# Altium schematic sheet Boost_Conv_V1.0_Power_Sch.SchDoc
size A4; SheetNumber: 1; SheetTotal: 3
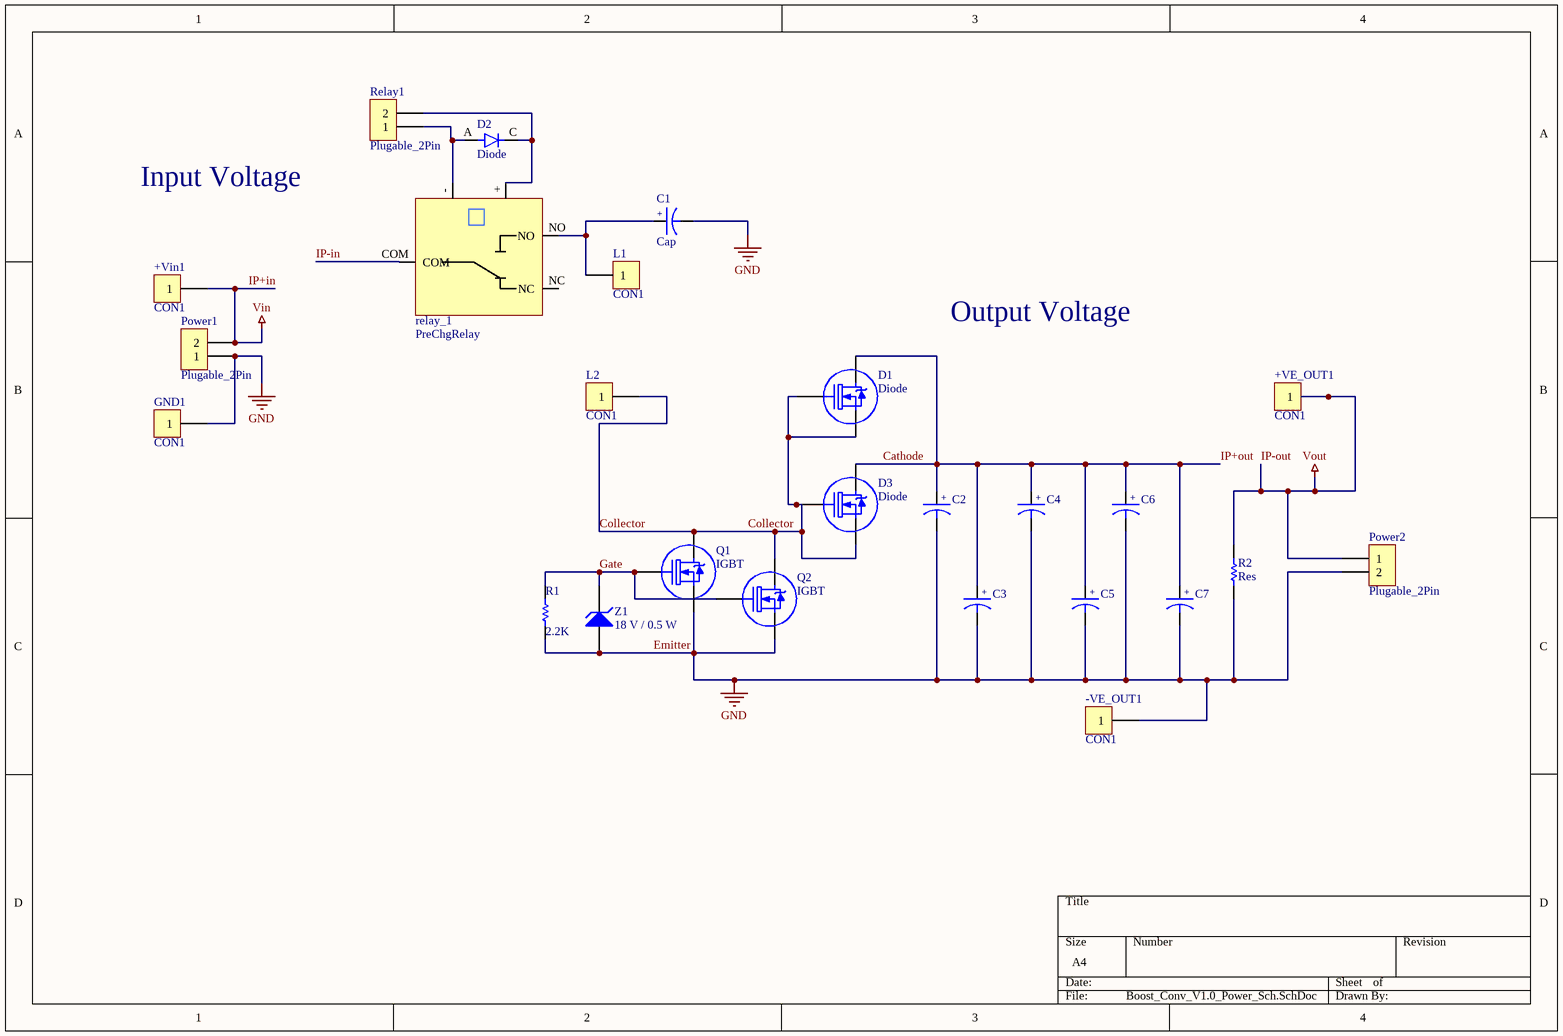
[diagram p0: Boost_Conv_V1.0_Power_Sch.SchDoc]

## Parts
+VE_OUT1  CON1  [WIRE6MM]
+Vin1  CON1  [WIRE6MM]
-VE_OUT1  CON1  [WIRE6MM]
C1  Cap  [DC-CAPACITOR]
C2  Cap  [DC-CAPACITOR]  (value not drawn)
C3  Cap  [DC-CAPACITOR]  (value not drawn)
C4  Cap  [DC-CAPACITOR]  (value not drawn)
C5  Cap  [DC-CAPACITOR]  (value not drawn)
C6  Cap  [DC-CAPACITOR]  (value not drawn)
C7  Cap  [DC-CAPACITOR]  (value not drawn)
D1  Diode  [To220]
D2  Diode  [DIOAD1060W80L520D270]
D3  Diode  [To220]
GND1  CON1  [WIRE6MM]
L1  CON1  [WIRE6MM]
L2  CON1  [WIRE6MM]
Power1  Plugable_2Pin  [TB2]
Power2  Plugable_2Pin  [TB2]
Q1  IGBT  [TO247]
Q2  IGBT  [TO247]
R1  value 2.2K  [AXIAL-0.3]  (hidden comment: Res1)
R2  Res  [R600]
Relay1  Plugable_2Pin  [TB2]
relay_1  PreChgRelay  [NT90TNCS12CB]
Z1  18 V / 0.5 W  [D3]

## Nets
Emitter: -VE_OUT1.1 C1.2 C2.2 C3.2 C4.2 C5.2 C6.2 C7.2 GND1.1 Power1.1 Power2.2 Q1.3(S) Q2.3(S) R1.1 R2.1 Z1.A  [also labelled GND]
IP+in: +Vin1.1 Power1.2  [also labelled Vin]
IP-out: +VE_OUT1.1 Power2.1 R2.2  [also labelled Vout]
Cathode: C2.1 C3.1 C4.1 C5.1 C6.1 C7.1 D1.2(D) D3.2(D)  [also labelled IP+out]
Collector: D1.1(G) D1.3(S) D3.1(G) D3.3(S) L2.1 Q1.2(D) Q2.2(D)
Gate: Q1.1(G) Q2.1(G) R1.2 Z1.K
IP-in: relay_1.COM
NetC1_1: C1.1 L1.1 relay_1.NO
NetD2_A: D2.A Relay1.1 relay_1.-
NetD2_C: D2.C Relay1.2 relay_1.+

Not connected (* = marked no-connect by the designer): relay_1 NC

## Notes on the sheet
- Input Voltage
- Output Voltage
- (in symbol CAPACITOR POL) +

## Library data of the parts
+VE_OUT1 +Vin1 -VE_OUT1 GND1 L1 L2 = CON1: Connector; SMD/TH: TH
C1-C7 = CAPACITOR POL: Electrolytic Capacitors; SMD/TH: TH; DPM/VM/AM: DPM, VM, AM; Value: 820 uF / 450 V
D1 D3 = IRF540N: N-Channel MOSFET; Value: FEP16; Published: 8-Jun-2000; LatestRevisionDate: 17-Jul-2002; LatestRevisionNote: Re-released for DXP Platform.; PackageVersion: 1995/1996; PackageReference: E3; Publisher: Altium Limited; PackageDescription: TO, Flat Index; 3 In-Line, Axial Leads; Body Dia. 4.6mm; Lead Dia. 0.5 mm (max)
D2 = 1N4007RL: Diode Standard 1000 V 1A Through Hole Axial; MF: ON Semiconductor; Availability: In Stock; Purchase-URL: https://pricing.snapeda.com/search/part/1N4007RL/?ref=eda; Package: DO-41-2 ON Semiconductor; MP: 1N4007RL; Value: 1N4007RL; Check_prices: https://www.snapeda.com/parts/1N4007RL/Onsemi/view-part/?ref=eda; SnapEDA_Link: https://www.snapeda.com/parts/1N4007RL/Onsemi/view-part/?ref=snap; Price: None
Power1 Power2 Relay1 = CON2: Connector; SMD/TH: TH
Q1 Q2 = IRF540N: N-Channel MOSFET; Value: IRGP4066; Published: 8-Jun-2000; LatestRevisionDate: 17-Jul-2002; LatestRevisionNote: Re-released for DXP Platform.; PackageVersion: 1995/1996; PackageReference: E3; Publisher: Altium Limited; PackageDescription: TO, Flat Index; 3 In-Line, Axial Leads; Body Dia. 4.6mm; Lead Dia. 0.5 mm (max)
R1 = Res1: Resistor; Published: 8-Jun-2000; LatestRevisionDate: 17-Jul-2002; LatestRevisionNote: Re-released for DXP Platform.; PackageReference: AXIAL-0.3; Publisher: Altium Limited; PackageDescription: Axial Device, Thru-Hole; 2 Leads; 0.3 in Pin Spacing
R2 = Res1: Resistor; SMD/TH: SMD; Value: 10k/0.5w
relay_1 = PreChgRelay: NT90THLCE12CB; Value: NT90THLCE12CB
Z1 = Zener_Diode: Zener diode; SMD/TH: SMD